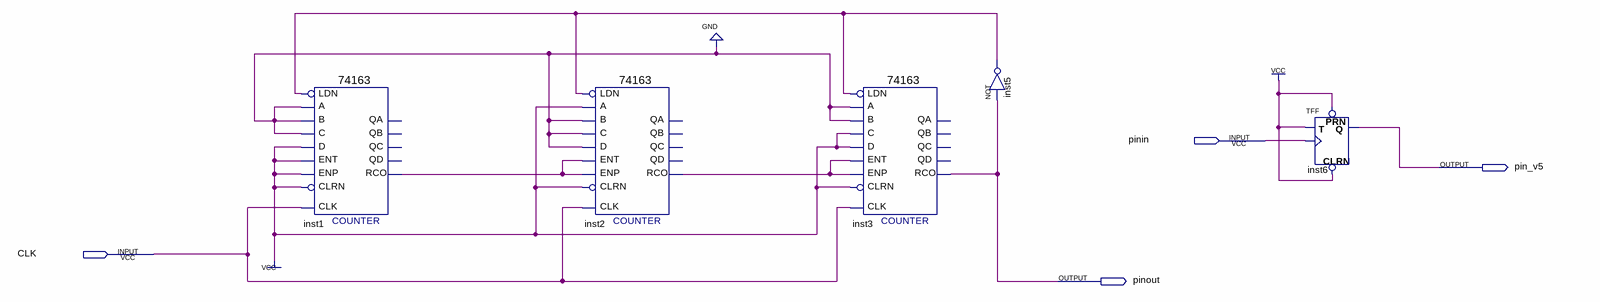
[diagram p0: schematic sheet]
// Quartus schematic La7part2.bdf as structural Verilog: 5 symbols, 4 pins
module La7part2 (
  input  pinin,
  input  CLK,
  output pin_v5,
  output pinout
);

  wire inst1_rco, inst2_rco, inst5_out;

  \74163  inst1 (
    .C(1'b0), .B(1'b0), .A(1'b0), .ENT(1'b1), .D(1'b1), .CLRN(1'b1), .CLK(CLK), .ENP(1'b1), .LDN(inst5_out),
    .RCO(inst1_rco));  // open: QA, QB, QC, QD
  \74163  inst2 (
    .C(1'b0), .B(1'b0), .A(1'b1), .ENT(inst1_rco), .D(1'b0), .CLRN(1'b1), .CLK(CLK), .ENP(inst1_rco),
    .LDN(inst5_out), .RCO(inst2_rco));  // open: QA, QB, QC, QD
  \74163  inst3 (
    .C(1'b1), .B(1'b0), .A(1'b0), .ENT(inst2_rco), .D(1'b1), .CLRN(1'b1), .CLK(CLK), .ENP(inst2_rco),
    .LDN(inst5_out), .RCO(pinout));  // open: QA, QB, QC, QD
  not inst5 (inst5_out, pinout);
  TFF inst6 (.PRN(1'b1), .CLRN(1'b1), .T(1'b1), .CLK(pinin), .Q(pin_v5));
endmodule
